# Altium schematic sheet DO_AN_2_SCHEMATIC.SchDoc
size A4; SheetNumber: 1; SheetTotal: 1
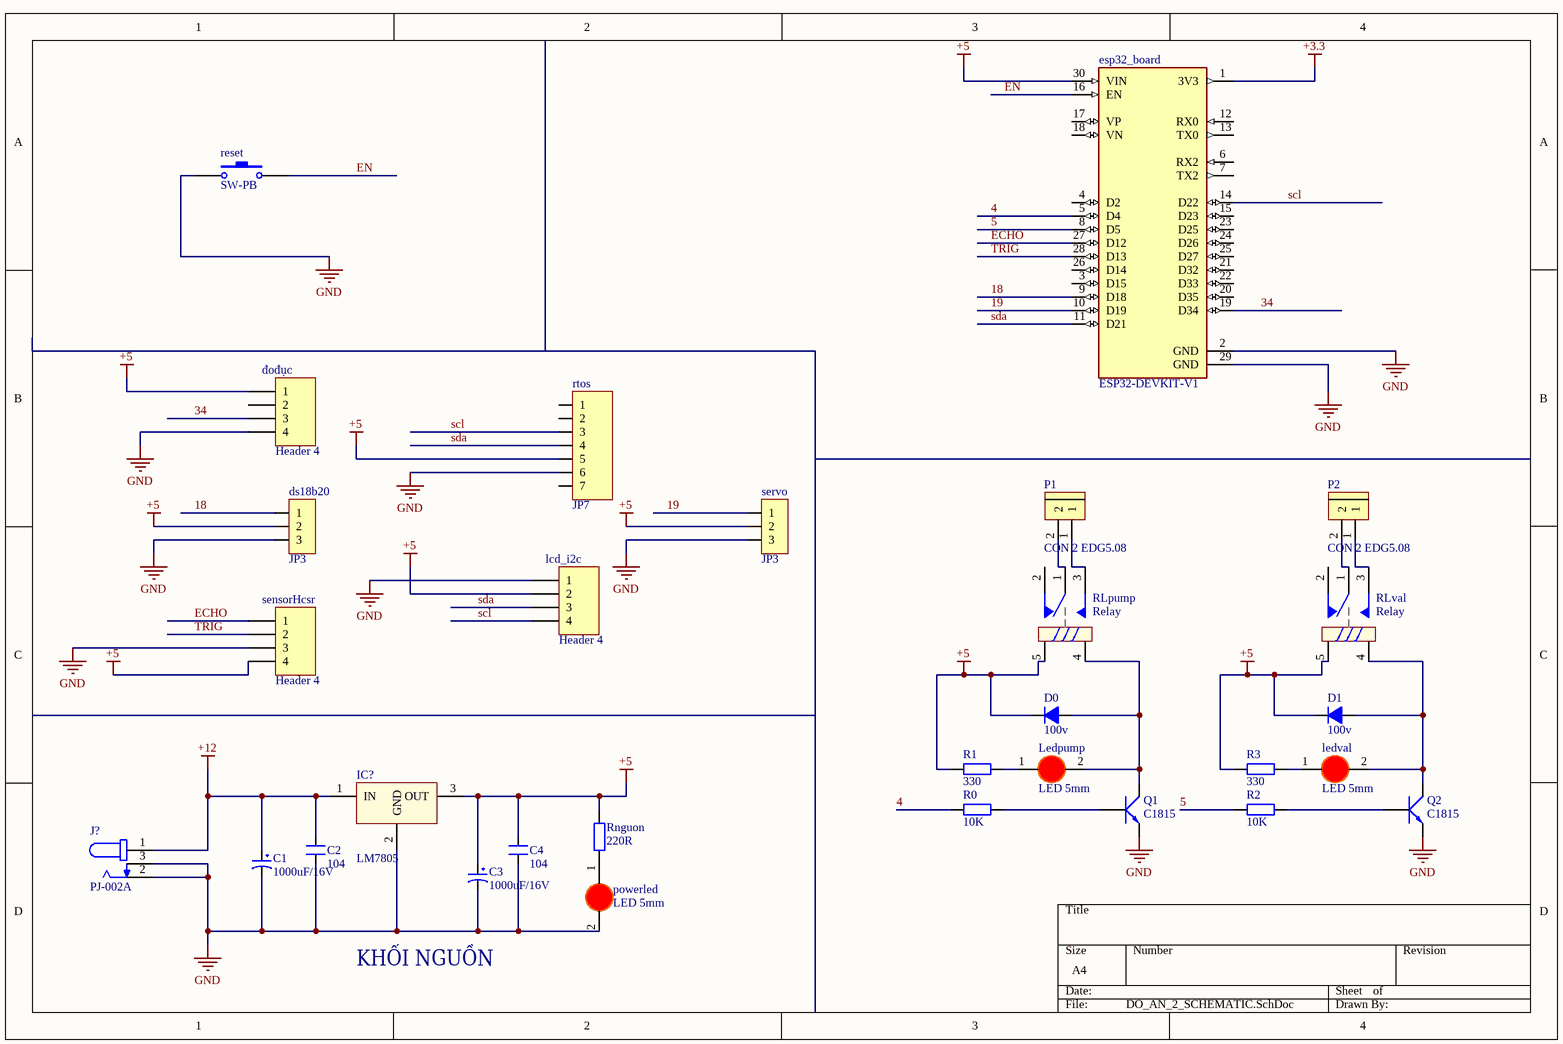
[diagram p0: DO_AN_2_SCHEMATIC.SchDoc]

## Parts
C1  1000uF/16V  [CP1.5/3.4]
C2  104  [CN2]
C3  1000uF/16V  [CP1.5/3.4]
C4  104  [CN2]
D0  100v  [DIODE 1A]
D1  100v  [DIODE 1A]
ds18b20  JP3  [JP3-C1T]
esp32_board  ESP32-DEVKIT-V1  [MODULE_ESP32_DEVKIT_V1]
IC?  LM7805  [QTO-220]
J?  PJ-002A  [CUI_PJ-002A]
lcd_i2c  Header 4  [HDR1X4]
Ledpump  LED 5mm  [LED-5MM-RED]
ledval  LED 5mm  [LED-5MM-RED]
P1  CON 2 EDG5.08  [CON 2 2EDG5.08]
P2  CON 2 EDG5.08  [CON 2 2EDG5.08]
powerled  LED 5mm  [LED-5MM-RED]
Q1  C1815  [TO92]
Q2  C1815  [TO92]
R0  10K  [tro vach 1/4w]
R1  330  [tro vach 1/4w]
R2  10K  [tro vach 1/4w]
R3  330  [tro vach 1/4w]
reset  SW-PB  [SPST-2]
RLpump  Relay  [Relay 5 Chan SRD]
RLval  Relay  [Relay 5 Chan SRD]
Rnguon  220R  [tro vach 1/4w]
rtos  JP7  [JP7-C1T]
sensorHcsr  Header 4  [HDR1X4]
servo  JP3  [JP3-C1T]
đođục  Header 4  [HDR1X4]

## Nets
+3.3: esp32_board.1(3V3)
+5: C3.1 C4.2 D0.2(K) D1.2(K) ds18b20.2 esp32_board.30(VIN) IC?.3(OUT) lcd_i2c.2 R1.1 R3.1 RLpump.5 RLval.5 Rnguon.2 rtos.5 sensorHcsr.4 servo.2 đođục.1
+12: C1.1 C2.2 IC?.1(IN) J?.1
GND: C1.2 C2.1 C3.2 C4.1 ds18b20.3 esp32_board.2(GND) esp32_board.29(GND) IC?.2(GND) J?.2 J?.3 lcd_i2c.1 powerled.2(K) Q1.1(E) Q2.1(E) reset.1 rtos.6 sensorHcsr.3 servo.3 đođục.4
4: esp32_board.5(D4) R0.1
5: esp32_board.8(D5) R2.1
18: ds18b20.1 esp32_board.9(D18)
19: esp32_board.10(D19) servo.1
34: esp32_board.19(D34) đođục.3
ECHO: esp32_board.27(D12) sensorHcsr.1
EN: esp32_board.16(EN) reset.2
scl: esp32_board.14(D22) lcd_i2c.4 rtos.3
sda: esp32_board.11(D21) lcd_i2c.3 rtos.4
TRIG: esp32_board.28(D13) sensorHcsr.2
NetD0_1: D0.1(A) Ledpump.2(K) Q1.2(C) RLpump.4
NetD1_1: D1.1(A) ledval.2(K) Q2.2(C) RLval.4
NetLedpump_1: Ledpump.1(A) R1.2
Netledval_1: ledval.1(A) R3.2
NetP1_1: P1.1 RLpump.3
NetP1_2: P1.2 RLpump.1
NetP2_1: P2.1 RLval.3
NetP2_2: P2.2 RLval.1
Netpowerled_1: powerled.1(A) Rnguon.1
NetQ1_3: Q1.3(B) R0.2
NetQ2_3: Q2.3(B) R2.2

Not connected (* = marked no-connect by the designer): esp32_board 3(D15) 4(D2) 6(RX2) 7(TX2) 12(RX0) 13(TX0) 15(D23) 17(VP) 18(VN) 20(D35) 21(D32) 22(D33) 23(D25) 24(D26) 25(D27) 26(D14); RLpump 2; RLval 2; rtos 1 2 7; đođục 2

## Notes on the sheet
- KHỐI NGUỒN

## Library data of the parts
C1 C3 = CP4: Cap 1000uF/16V - 220uF/50V; Description 5: 4,7uF>10uF/250V_3,3uF>10uF/400V - 2,2uF>4,7uF/450V; Description 1: 2200uF-3300uF/6,3V - 1000uF-2200uF/10V; Description 2: 1000uF/16V - 470uF => 1000uF/25V - 100uF/100V; Description 3: 330uF>470uF/35V_220uF>470uF/50V_10uF>22uF/250V; Description 4: 220uF => 330uF/63V - 10uF =>33uF/160 - 200V; Value: 1000uF/16V
C2 C4 = CN2: Cap np 104 => 105pF; Value: 0.1uF
D0 D1 = Diode 1N4007: Cắm; Ten_Linh_Kien: Diode 1N4007 1A (DIP); Don_Vi: Con; Ma_Hang: MH001063; Ghi Chu: *; Kieu_Chan: *; Chung_Loai: Cắm
ds18b20 servo = JP3: WR-PHD 2.54 mm Angled Socket Header; Manufacturer: W¨¹rth Elektronik eiSos GmbH; partNo: 613003143121; ComponentLink1 Description: Manufacturer; ComponentLink2 Description: Datasheet; NoPins: 03; Created Date: 29 March 2013; ComponentLink1URL: http://www.we-online.com; ComponentLink2URL: http://katalog.we-online.de/em/datasheet/6130xx143121.pdf; Created by: Karrer Zheng
esp32_board = ESP32-DEVKIT-V1: Dual core, Wi-Fi: 2.4 GHz up to 150 Mbits/s,BLE (Bluetooth Low Energy) and legacy Bluetooth, 32 bits, Up to 240 MHz; MF: Do it; Price: None; Availability: Not in stock; Package: None; MP: ESP32-DEVKIT-V1; Value: *; SnapEDA_Link: https://www.snapeda.com/parts/ESP32-DEVKIT-V1/Do+it/view-part/?ref=snap; Check_prices: https://www.snapeda.com/parts/ESP32-DEVKIT-V1/Do+it/view-part/?ref=eda
IC? = LM78xx: On ap +, from + 5 to + 24VDC; Value: LM7805
J? = PJ-002A: 2.0 x 6.5 mm, 2.5 A, Horizontal, Through Hole, Dc Power Jack Connector; MF: CUI Devices; MP: PJ-002A; Check_prices: https://www.snapeda.com/parts/PJ-002A/CUI+Devices/view-part/?ref=eda; Availability: In Stock; CUI_purchase_URL: https://www.cuidevices.com/product/interconnect/connectors/dc-power-connectors/jacks/pj-002a?utm_source=snapeda.com&utm_medium=referral&utm_campaign=snapedaBOM; SnapEDA_Link: https://www.snapeda.com/parts/PJ-002A/CUI+Devices/view-part/?ref=snap; Purchase-URL: https://pricing.snapeda.com/search/part/PJ-002A/?ref=eda; Price: None; Package: None; Value: *
lcd_i2c sensorHcsr đođục = Header 4: Header, 4-Pin; LatestRevisionDate: 17-Jul-2002; LatestRevisionNote: Re-released for DXP Platform.; Publisher: Altium Limited
Ledpump ledval powerled = LED 5mm Do: Cắm; Don_Vi: Con; Ma_Hang: MH008967; Ten_Linh_Kien: Led 5MM Phủ Đỏ (1000c); Ghi_Chu: *; Kieu_Chan: *; Chung_Loai: Cắm
P1 P2 = CON 2 EDG5.08: Cắm; Ten_Linh_Kien: CON 2 2EDG5.08-2P 5.08MM ( Xanh Cong); Ma_Hang: MH000759; Ghi_Chu: *; Don_Vi: Con; Kieu_Chan: *; Chung_Loai: Cắm
Q1 Q2 = C1815: NPN transistor; Value: C9014
R0-R3 Rnguon = Tro Vach 1/4W 5% 220R: Cắm; Don_Vi: Con; So_Chan: 2; Ten_Linh_Kien: Trở Vạch 1/4w 5% 220R; Ma_Hang: MH007300; Chung_Loai: Cắm; Kieu_Chan: *
reset = SW-PB: Switch; Published: 24-Mar-1999; LatestRevisionDate: 17-Jul-2002; LatestRevisionNote: Re-released for DXP Platform.; PackageReference: SPST-2; Publisher: Altium Limited; PackageDescription: Switch; 2 Leads
RLpump RLval = Relay 5 Chan SRD: Relay 5 Chan; Ma_Hang: MH009374; Ten: Relay 5V10A SRD-05VDC-SL-C Chính Hãng
rtos = JP7: WR-PHD 2.54 mm Angled Socket Header; Manufacturer: W¨¹rth Elektronik eiSos GmbH; partNo: 613007143121; ComponentLink1 Description: Manufacturer; ComponentLink2 Description: Datasheet; NoPins: 07; Created Date: 29 March 2013; ComponentLink1URL: http://www.we-online.com; ComponentLink2URL: http://katalog.we-online.de/em/datasheet/6130xx143121.pdf; Created by: Karrer Zheng